# Altium schematic sheet Archimedes_Isil_Mosfet_Kati.SchDoc: Isıl - Mosfet Sürücü Katı Tasarımı
size A4; DrawnBy: Emre Rasim; DocumentNumber: 7; Revision: 1.1; SheetNumber: 4; SheetTotal: 8; Sematikicerigi: Isıl - Mosfet Sürücü Katı Tasarımı
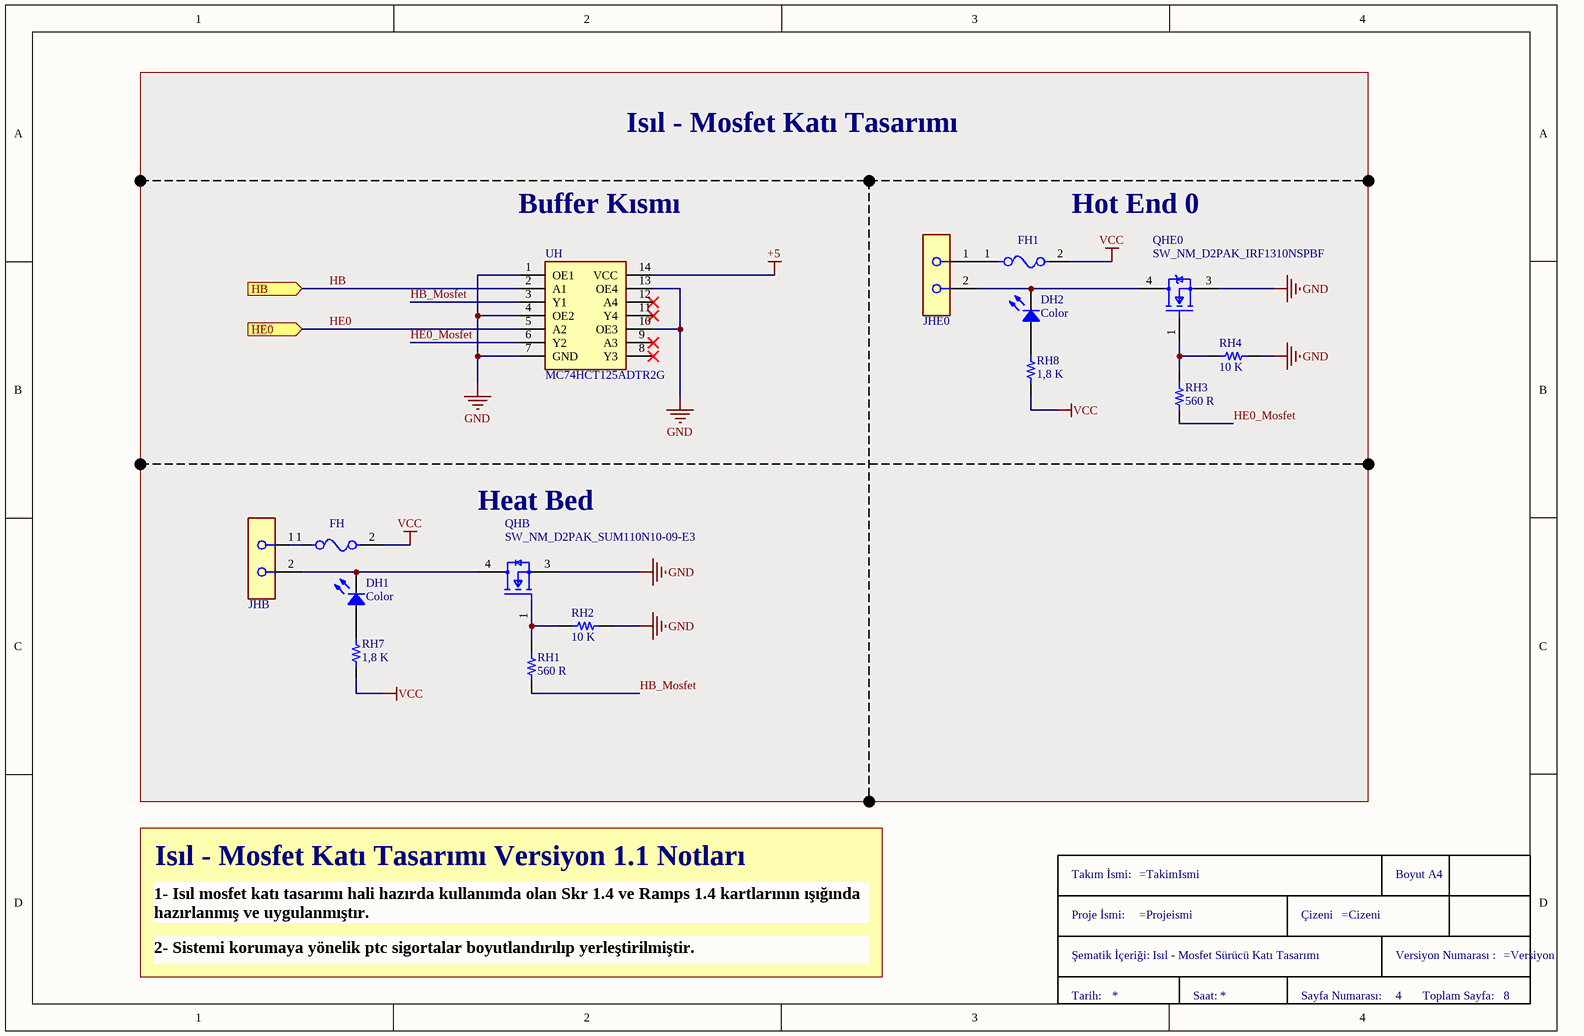
[diagram p0: Archimedes_Isil_Mosfet_Kati.SchDoc]

## Parts
DH1  Color  [LED 0805/2012 GREEN]
DH2  Color  [LED 0805/2012 GREEN]
FH  VR_PTC_FRU900-30F  [VR_PTC_FRU900-30F]  (value not drawn)
FH1  VR_PTC_FRU300-30F  [VR_PTC_FRU300-30F]  (value not drawn)
JHB  Con_5mm_2 lead  [Con_5mm_2lead]  (value not drawn)
JHE0  Con_5mm_2 lead  [Con_5mm_2lead]  (value not drawn)
QHB  SW_NM_D2PAK_SUM110N10-09-E3  [SW_D2PAK_Vishay_SUM110N10-09]
QHE0  SW_NM_D2PAK_IRF1310NSPBF  [SW_D2PAK_NMOS_IOR_IRF1310NSTRLPBF]
RH1  560 R  [RES 0805/2012]
RH2  10 K  [RES 0805/2012]
RH3  560 R  [RES 0805/2012]
RH4  10 K  [RES 0805/2012]
RH7  1,8 K  [RES 0805/2012]
RH8  1,8 K  [RES 0805/2012]
TitleBlock-A4  TitleBlock-A4  (value not drawn)  (graphical)
UH  MC74HCT125ADTR2G  [IC_Tssop14_MC74HCT125ADTR2G]

## Ports
HB (in), HE0 (in)

## Nets
+5: UH.14(VCC)
GND: QHB.3(S) QHE0.3(S) RH2.1 RH4.1 UH.1(OE1) UH.4(OE2) UH.7(GND) UH.10(OE3) UH.13(OE4)
VCC: FH.2 FH1.2 RH7.2 RH8.2
HB: UH.2(A1) ; port HB
HB_Mosfet: RH1.1 UH.3(Y1)
HE0: UH.5(A2) ; port HE0
HE0_Mosfet: RH3.1 UH.6(Y2)
NetDH1_1: DH1.1 RH7.1
NetDH1_2: DH1.2 JHB.2 QHB.4(D)
NetDH2_1: DH2.1 RH8.1
NetDH2_2: DH2.2 JHE0.2 QHE0.4(D)
NetFH1_1: FH1.1 JHE0.1
NetFH_1: FH.1 JHB.1
NetQHB_1: QHB.1(G) RH1.2 RH2.2
NetQHE0_1: QHE0.1(G) RH3.2 RH4.2

Not connected (* = marked no-connect by the designer): UH 8(Y3)* 9(A3)* 11(Y4)* 12(A4)*

## Notes on the sheet
- Isıl - Mosfet Katı Tasarımı
- Buffer Kısmı
- Hot End 0
- Heat Bed
- Isıl - Mosfet Katı Tasarımı Versiyon 1.1 Notları
- 1- Isıl mosfet katı tasarımı hali hazırda kullanımda olan Skr 1.4 ve Ramps 1.4 kartlarının ışığında hazırlanmış ve uygulanmıştır.
- 2- Sistemi korumaya yönelik ptc sigortalar boyutlandırılıp yerleştirilmiştir.
- (in symbol TitleBlock-A4) Takım İsmi:; Boyut A4; Proje İsmi:; Çizeni; Şematik İçeriği:; Versiyon Numarası :; Tarih:; Saat:; Sayfa Numarası:; Toplam Sayfa:

## Library data of the parts
DH1 DH2 = LED 805
FH = VR_PTC_FRU900-30F: Ptc Fuse with 9 Amper hold and 18 Amper trip values
FH1 = VR_PTC_FRU300-30F: Ptc Fuse with 3 Amper hold and 6 Amper Trip values
JHB JHE0 = Con_5mm_2 lead: TERM BLOCK 2POS SIDE ENTRY 5MM
QHB = SW_NM_D2PAK_SUM110N10-09-E3: Vishay SUM110N10 nmos with d2pak package , 100 volt and 110 amper values
QHE0 = SW_NM_D2PAK_IRF1310NSPBF: IOR IRF1310NSPBF NMOS with 100 volt and 42 amper ratings
RH1 RH3 = Resistor 805: 560 R ohm Resistor  with 805 pack and %1 tolerance rating
RH2 RH4 = Resistor 805: 10 K ohm Resistor  with 805 pack and %1 tolerance rating
RH7 = Resistor 805: 1,8 K ohm Resistor  with 805 pack and %1 tolerance rating
RH8 = Resistor 805: 1,8 K K ohm Resistor  with 805 pack and %1 tolerance rating
TitleBlock-A4 = TitleBlock-A4: Title Block for İTU eklemeli imalat takımı
UH = IC_MC74HCT125ADTR2G: ON SEMICONDUCTOR - MC74HCT125ADTR2G - Buffer, Non Inverting, 74HCT125A, 2 V to 6 V, TSSOP-14; Manufacturer_Name: onsemi; Geometry.Height: 1.2mm; Manufacturer_Part_Number: MC74HCT125ADTR2G; Mouser Part Number: 863-MC74HCT125ADTR2G; Mouser Price/Stock: https://www.mouser.co.uk/ProductDetail/onsemi/MC74HCT125ADTR2G?qs=mB5q98eOMcZnEC08OY8tTw%3D%3D; Arrow Part Number: MC74HCT125ADTR2G; Arrow Price/Stock: https://www.arrow.com/en/products/mc74hct125adtr2g/on-semiconductor; Datasheet Link: https://www.arrow.com/en/products/mc74hct125adtr2g/on-semiconductor